# Altium schematic sheet usb.SchDoc: {Наименование}
size 209 x 297 mm; DocumentNumber: {Обозначение}; SheetNumber: 4; SheetTotal: 4; PageSetup: Record=PageOptions|CenterHorizontal=False|CenterVertical=False|PrintScale=0.95|XCorrection=0.00|YCorrection=0.00|PrintKind=1|BorderSize=5000000|LeftOffset=0|BottomOffset=0|Orientation=1|PaperLength=1000|PaperWidth=1000|Scale=100|PaperSource=15|PrintQuality=600|MediaType=1|DitherType=10|PaperKind=A4|PrintScaleMode=1; Rule: PcbType=ProtelPcb
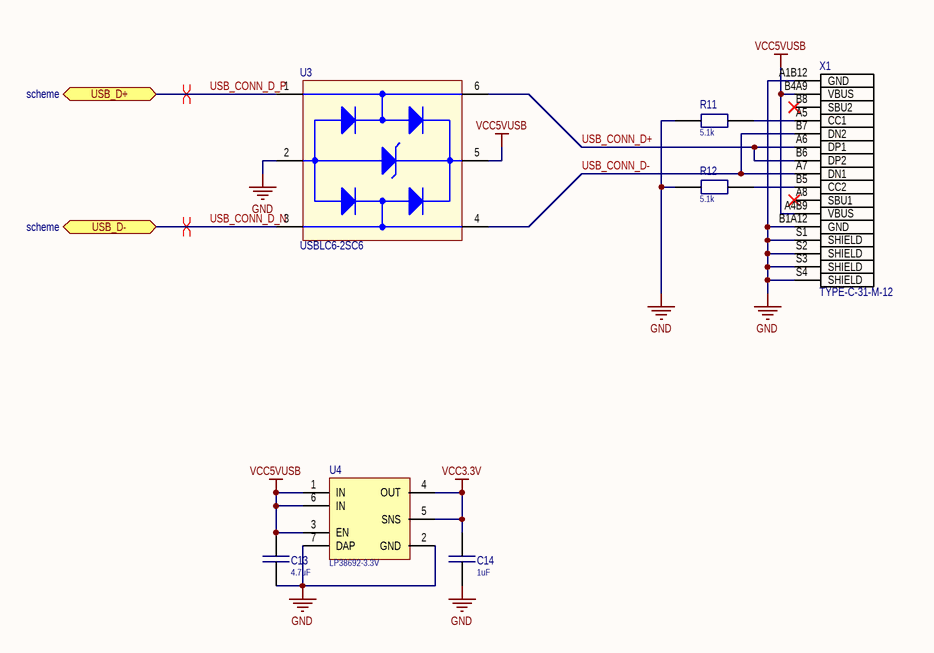
[diagram p0: usb.SchDoc]

## Parts
C13  4.7uF  [C_0603]
C14  1uF  [C_0603]
R11  5.1k  [R_0603]
R12  5.1k  [R_0603]
U3  USBLC6-2SC6  [SOT95P280X145-6N]
U4  LP38692-3.3V  [WSON-6]
X1  TYPE-C-31-M-12  [HRO_TYPE-C-31-M-12]

## Ports
USB_D+ (bidir, see scheme), USB_D- (bidir, see scheme)

## Nets
GND: C13.1 C14.1 R11.1 R12.1 U3.2(GND) U4.2(GND) U4.7(DAP) X1.A1B12(GND) X1.B1A12(GND) X1.S1(SHIELD) X1.S2(SHIELD) X1.S3(SHIELD) X1.S4(SHIELD)
VCC3.3V: C14.2 U4.4(OUT) U4.5(SNS)
VCC5VUSB: C13.2 U3.5(VBUS) U4.1(IN) U4.3(EN) U4.6(IN) X1.A4B9(VBUS) X1.B4A9(VBUS)
USB_CONN_D+: U3.6(I/O1_OUT) X1.A6(DP1) X1.B6(DP2)
USB_CONN_D-: U3.4(I/O2_OUT) X1.A7(DN1) X1.B7(DN2)
USB_CONN_D_N: U3.3(I/O2_IN) ; port USB_D-
USB_CONN_D_P: U3.1(I/O1_IN) ; port USB_D+
NetR11_2: R11.2 X1.A5(CC1)
NetR12_2: R12.2 X1.B5(CC2)

Not connected (* = marked no-connect by the designer): X1 A8(SBU1)* B8(SBU2)*

## Layout directives
differential pair: USB_CONN_D_N, USB_CONN_D_P

## Notes on the sheet
- Подп. и дата
- Инв. № дубл.
- Взам. инв. №
- Инв. № подл.
- Лист
- Изм.
- № докум.
- Подп.
- Дата

## Library data of the parts
C13 = CAP_SMD: Capacitor; Part Number: CC0603KRX5R6BB475; Alternative Part: *; Value: 4.7uF
C14 = CAP_SMD: Capacitor; Part Number: CC0603ZRY5V7BB105; Alternative Part: *; Value: 1uF
R11 R12 = RES_SMD: Resistor; Part Number: RC0603FR-075K1L; Alternative Part: *; Value: 5.1k
U3 = USBLC6-2SC6: 17V Clamp 5A (8/20Âµs) Ipp Tvs Diode Surface Mount SOT-23-6; MF: STMicroelectronics; Value: *; Check_prices: https://www.snapeda.com/parts/USBLC6-2SC6/STMicroelectronics/view-part/?ref=eda; MP: USBLC6-2SC6; Purchase-URL: https://pricing.snapeda.com/search/part/USBLC6-2SC6/?ref=eda; Price: None; Availability: In Stock; Package: SOT-23-6 STMicroelectronics; SnapEDA_Link: https://www.snapeda.com/parts/USBLC6-2SC6/STMicroelectronics/view-part/?ref=snap; Part Number: USBLC6-2SC6; Alternative Part: *
U4 = LP38692: LP38690, LP38692 1-A LDO CMOS Linear Regulators  Stable with Ceramic Output Capacitors
X1 = TYPE-C-31-M-12: USB Connectors 24 Receptacle 1 8.94*7.3mm RoHS; Package: None; Availability: Unavailable; Value: *; MP: TYPE-C-31-M-12; Price: None; System: Connector; Part Number: TYPE-C-31-M-12